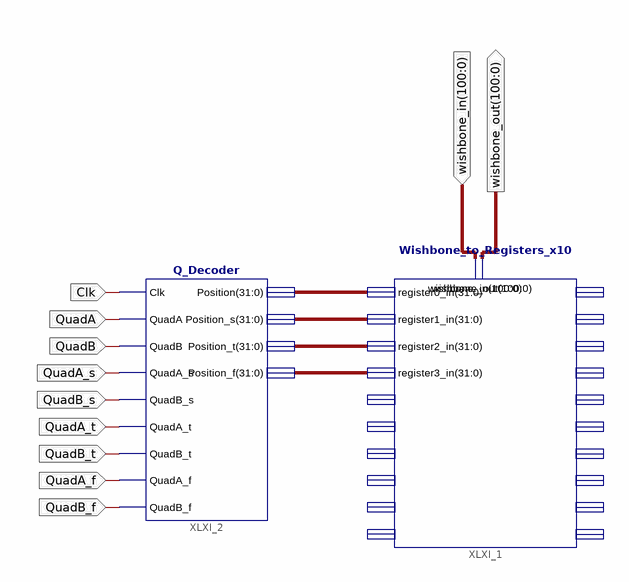
[diagram p0: schematic sheet 1]
// Xilinx ISE schematic Quadrature_decoder.sch (spartan6) as structural Verilog: 2 symbols, 11 ports
module Quadrature_decoder (
  input  [100:0] wishbone_in,
  input  Clk,
  input  QuadA,
  input  QuadB,
  input  QuadA_s,
  input  QuadB_s,
  input  QuadA_t,
  input  QuadB_t,
  input  QuadA_f,
  input  QuadB_f,
  output [100:0] wishbone_out
);

  wire [31:0] XLXN_1, XLXN_2, XLXN_3, XLXN_4;

  Wishbone_to_Registers_x10 XLXI_1 (
    .register0_in(XLXN_1), .register1_in(XLXN_2), .register2_in(XLXN_3), .register3_in(XLXN_4),
    .wishbone_in(wishbone_in), .wishbone_out(wishbone_out));  // open: register4_in, register5_in, register6_in, register7_in, register8_in, register9_in, register0_out, register1_out, register2_out, register3_out, register4_out, register5_out, register6_out, register7_out, register8_out, register9_out
  Q_Decoder XLXI_2 (
    .Clk(Clk), .QuadA(QuadA), .QuadB(QuadB), .QuadA_s(QuadA_s), .QuadB_s(QuadB_s), .QuadA_t(QuadA_t),
    .QuadB_t(QuadB_t), .QuadA_f(QuadA_f), .QuadB_f(QuadB_f), .Position(XLXN_1), .Position_s(XLXN_2),
    .Position_t(XLXN_3), .Position_f(XLXN_4));
endmodule
